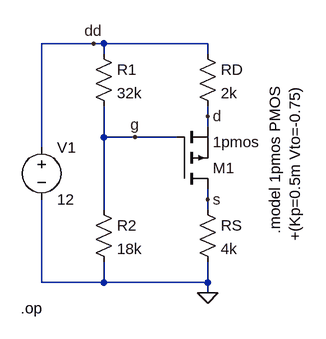
[diagram p0: schematic 13-3-4-b-1.asc]
13-3-4-b-1.asc, the LTspice schematic file:
Version 4
SHEET 1 880 680
WIRE 80 -32 0 -32
WIRE 96 -32 80 -32
WIRE 256 -32 96 -32
WIRE 96 -16 96 -32
WIRE 256 -16 256 -32
WIRE 256 80 256 64
WIRE 256 96 256 80
WIRE 96 112 96 64
WIRE 144 112 96 112
WIRE 208 112 144 112
WIRE 0 128 0 -32
WIRE 256 208 256 192
WIRE 96 224 96 112
WIRE 256 224 256 208
WIRE 0 336 0 208
WIRE 96 336 96 304
WIRE 96 336 0 336
WIRE 256 336 256 304
WIRE 256 336 96 336
WIRE 256 352 256 336
FLAG 256 352 0
FLAG 80 -32 dd
FLAG 144 112 g
FLAG 256 80 d
FLAG 256 208 s
SYMBOL res 80 -32 R0
SYMATTR InstName R1
SYMATTR Value 32k
SYMBOL res 80 208 R0
SYMATTR InstName R2
SYMATTR Value 18k
SYMBOL res 240 -32 R0
SYMATTR InstName RD
SYMATTR Value 2k
SYMBOL voltage 0 112 R0
WINDOW 123 0 0 Left 0
WINDOW 39 0 0 Left 0
SYMATTR InstName V1
SYMATTR Value 12
SYMBOL res 240 208 R0
SYMATTR InstName RS
SYMATTR Value 4k
SYMBOL pmos 208 192 M180
SYMATTR InstName M1
SYMATTR Value 1pmos
TEXT 360 32 VRight 2 !.model 1pmos PMOS\n+(Kp=0.5m Vto=-0.75)
TEXT -32 376 Left 2 !.op

The netlist it stands for:
* 13-3-4-b-1.asc
R1 dd g 32k
R2 g 0 18k
RD dd d 2k
V1 dd 0 12
RS s 0 4k
M1 s g d d 1pmos
.model NMOS NMOS
.model PMOS PMOS
.lib standard.mos
.model 1pmos PMOS
+(Kp=0.5m Vto=-0.75)
.op
.backanno
.end